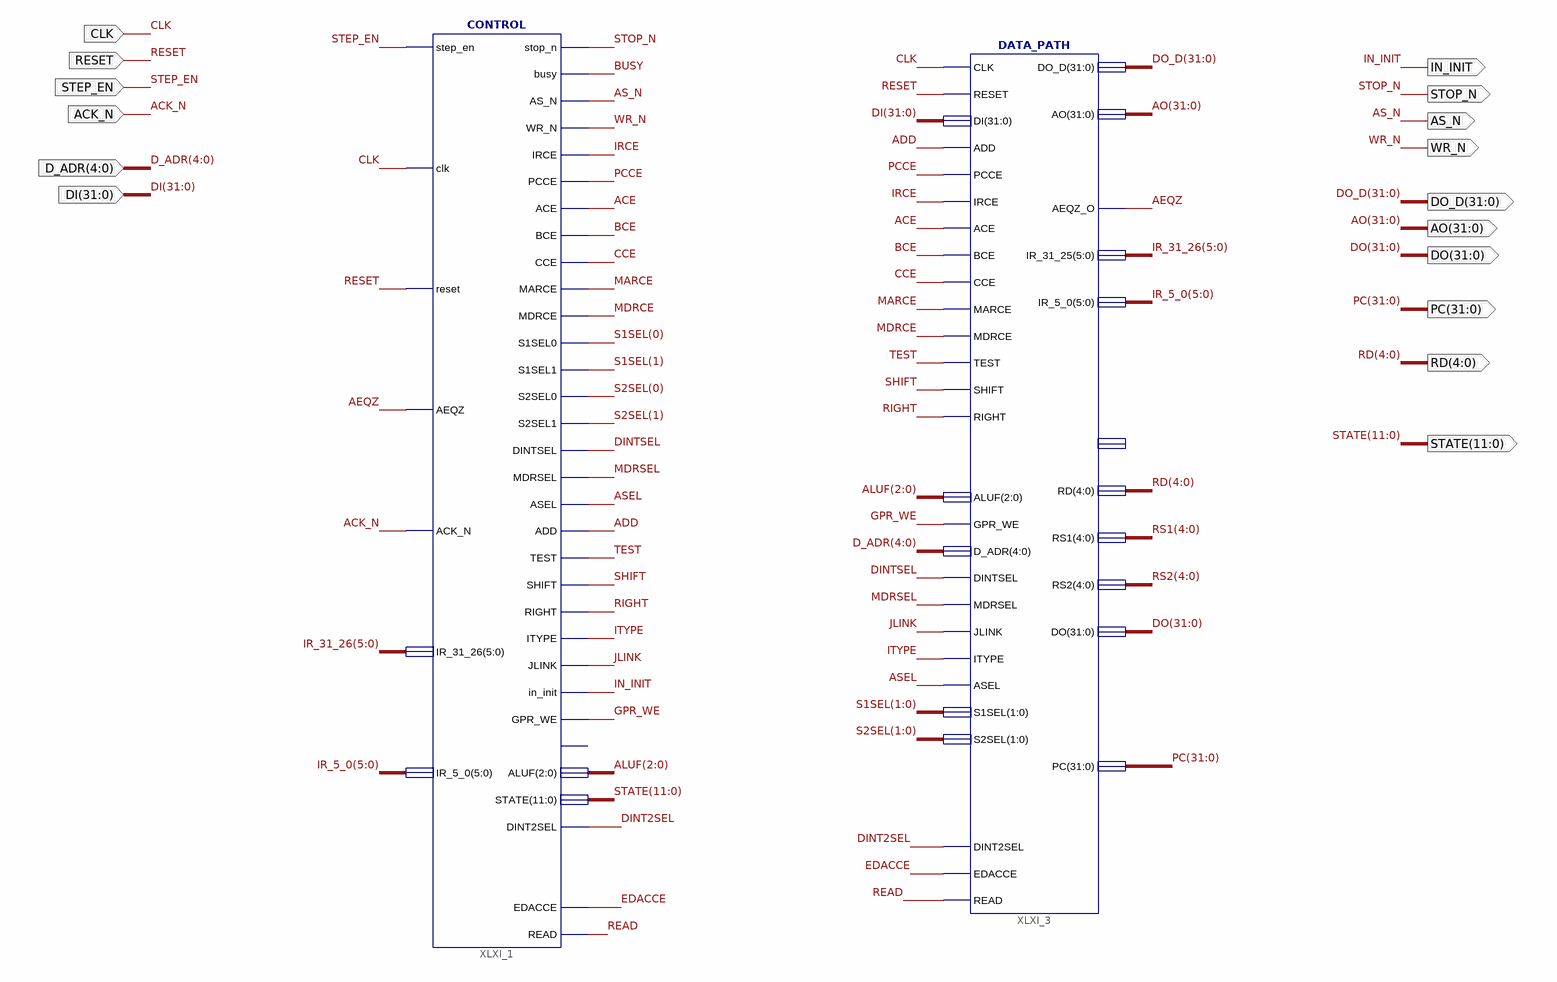
[diagram p0: schematic sheet 1]
// Xilinx ISE schematic DLX.sch (spartan6) as structural Verilog: 2 symbols, 16 ports
module DLX (
  input  [31:0] DI,
  input  [4:0] D_ADR,
  input  CLK,
  input  RESET,
  input  ACK_N,
  input  STEP_EN,
  output [31:0] DO_D,
  output [31:0] AO,
  output [4:0] RD,
  output [31:0] DO,
  output IN_INIT,
  output [11:0] STATE,
  output STOP_N,
  output AS_N,
  output WR_N,
  output [31:0] PC
);

  wire ACE, ADD, AEQZ, ASEL, BCE, BUSY, CCE, DINT2SEL, DINTSEL, EDACCE, GPR_WE, IRCE, ITYPE, JLINK, MARCE,
       MDRCE, MDRSEL, PCCE, READ, RIGHT, SHIFT, TEST;
  wire [1:0] S1SEL, S2SEL;
  wire [2:0] ALUF;
  wire [4:0] RS1, RS2;
  wire [5:0] IR_5_0, IR_31_26;

  CONTROL XLXI_1 (
    .step_en(STEP_EN), .clk(CLK), .reset(RESET), .AEQZ(AEQZ), .ACK_N(ACK_N), .IR_31_26(IR_31_26),
    .IR_5_0(IR_5_0), .stop_n(STOP_N), .busy(BUSY), .AS_N(AS_N), .WR_N(WR_N), .IRCE(IRCE), .PCCE(PCCE),
    .ACE(ACE), .BCE(BCE), .CCE(CCE), .MARCE(MARCE), .MDRCE(MDRCE), .EDACCE(EDACCE), .S1SEL0(S1SEL[0]),
    .S1SEL1(S1SEL[1]), .S2SEL0(S2SEL[0]), .S2SEL1(S2SEL[1]), .DINTSEL(DINTSEL), .DINT2SEL(DINT2SEL),
    .MDRSEL(MDRSEL), .ASEL(ASEL), .ADD(ADD), .TEST(TEST), .SHIFT(SHIFT), .RIGHT(RIGHT), .ITYPE(ITYPE),
    .JLINK(JLINK), .in_init(IN_INIT), .GPR_WE(GPR_WE), .ALUF(ALUF), .STATE(STATE), .READ(READ));  // open: bt
  DATA_PATH XLXI_3 (
    .CLK(CLK), .RESET(RESET), .DI(DI), .ADD(ADD), .PCCE(PCCE), .IRCE(IRCE), .ACE(ACE), .BCE(BCE), .CCE(CCE),
    .MARCE(MARCE), .MDRCE(MDRCE), .TEST(TEST), .SHIFT(SHIFT), .RIGHT(RIGHT), .ALUF(ALUF), .GPR_WE(GPR_WE),
    .D_ADR(D_ADR), .DINTSEL(DINTSEL), .MDRSEL(MDRSEL), .JLINK(JLINK), .ITYPE(ITYPE), .ASEL(ASEL),
    .S1SEL(S1SEL), .S2SEL(S2SEL), .DINT2SEL(DINT2SEL), .EDACCE(EDACCE), .READ(READ), .DO_D(DO_D), .AO(AO),
    .AEQZ_O(AEQZ), .IR_31_25(IR_31_26), .IR_5_0(IR_5_0), .PC(PC), .RD(RD), .RS1(RS1), .RS2(RS2), .DO(DO));  // open: IMM
endmodule
